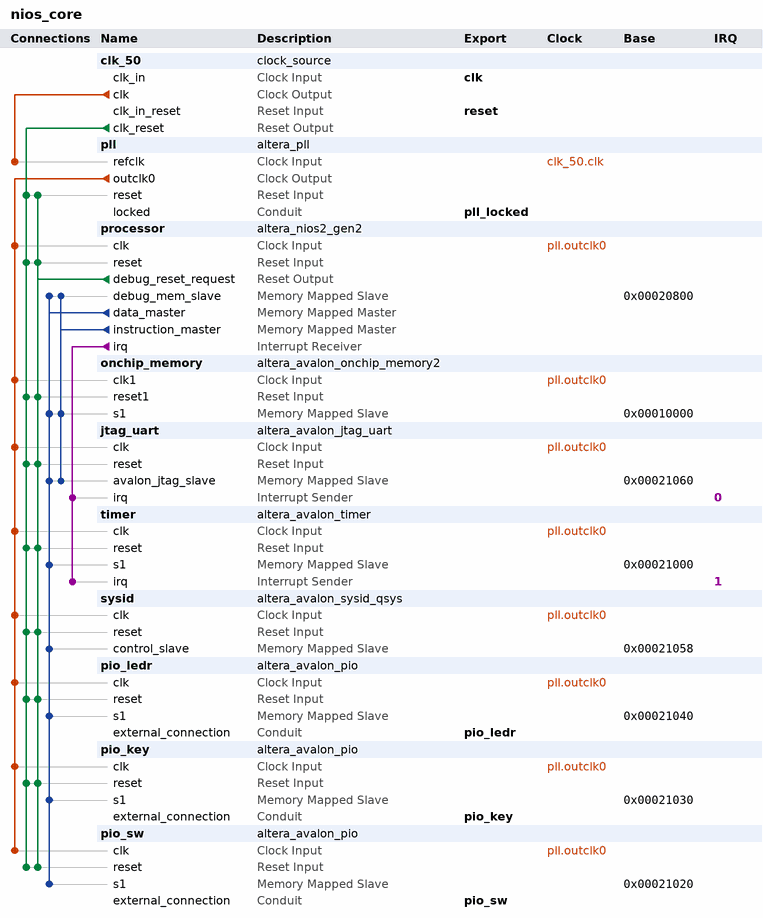
[diagram p0: system contents]
# Platform Designer (Qsys) system nios_core, Cyclone V 5CSXFC6D6F31C6
# Parameters at their usual value, and those the tool derives, are not listed.
package require -exact qsys 18.1
create_system nios_core
set_project_property DEVICE_FAMILY {Cyclone V}
set_project_property DEVICE 5CSXFC6D6F31C6

add_instance clk_50 clock_source 18.1
set_instance_parameter_value clk_50 clockFrequency 50000000

add_instance pll altera_pll 18.1
set_instance_parameter_value pll gui_device_speed_grade 1
set_instance_parameter_value pll gui_number_of_clocks 1
set_instance_parameter_value pll gui_operation_mode direct
set_instance_parameter_value pll gui_output_clock_frequency0 125.0
set_instance_parameter_value pll gui_pll_mode {Integer-N PLL}
set_instance_parameter_value pll gui_reference_clock_frequency 50.0
set_instance_parameter_value pll gui_use_locked true

add_instance processor altera_nios2_gen2 18.1
set_instance_parameter_value processor dcache_size 2048
set_instance_parameter_value processor exceptionSlave onchip_memory.s1
set_instance_parameter_value processor icache_size 4096
set_instance_parameter_value processor impl Fast
set_instance_parameter_value processor resetSlave onchip_memory.s1

add_instance onchip_memory altera_avalon_onchip_memory2 18.1
set_instance_parameter_value onchip_memory dataWidth 32
set_instance_parameter_value onchip_memory dualPort false
set_instance_parameter_value onchip_memory initMemContent true
set_instance_parameter_value onchip_memory initializationFileName onchip_mem.hex
set_instance_parameter_value onchip_memory memorySize 65536

add_instance jtag_uart altera_avalon_jtag_uart 18.1
set_instance_parameter_value jtag_uart simInteractiveOptions NO_INTERACTIVE_WINDOWS

add_instance timer altera_avalon_timer 18.1
set_instance_parameter_value timer period 1
set_instance_parameter_value timer periodUnits MSEC

add_instance sysid altera_avalon_sysid_qsys 18.1
set_instance_parameter_value sysid id 305419896

add_instance pio_ledr altera_avalon_pio 18.1
set_instance_parameter_value pio_ledr direction Output
set_instance_parameter_value pio_ledr width 8

add_instance pio_key altera_avalon_pio 18.1
set_instance_parameter_value pio_key direction Input
set_instance_parameter_value pio_key width 4

add_instance pio_sw altera_avalon_pio 18.1
set_instance_parameter_value pio_sw direction Input
set_instance_parameter_value pio_sw width 8

# connections
add_connection clk_50.clk pll.refclk clock
add_connection pll.outclk0 jtag_uart.clk clock
add_connection pll.outclk0 onchip_memory.clk1 clock
add_connection pll.outclk0 pio_key.clk clock
add_connection pll.outclk0 pio_ledr.clk clock
add_connection pll.outclk0 pio_sw.clk clock
add_connection pll.outclk0 processor.clk clock
add_connection pll.outclk0 sysid.clk clock
add_connection pll.outclk0 timer.clk clock
add_connection clk_50.clk_reset jtag_uart.reset reset
add_connection clk_50.clk_reset onchip_memory.reset1 reset
add_connection clk_50.clk_reset pio_key.reset reset
add_connection clk_50.clk_reset pio_ledr.reset reset
add_connection clk_50.clk_reset pio_sw.reset reset
add_connection clk_50.clk_reset pll.reset reset
add_connection clk_50.clk_reset processor.reset reset
add_connection clk_50.clk_reset sysid.reset reset
add_connection clk_50.clk_reset timer.reset reset
add_connection processor.debug_reset_request jtag_uart.reset reset
add_connection processor.debug_reset_request onchip_memory.reset1 reset
add_connection processor.debug_reset_request pio_key.reset reset
add_connection processor.debug_reset_request pio_ledr.reset reset
add_connection processor.debug_reset_request pio_sw.reset reset
add_connection processor.debug_reset_request pll.reset reset
add_connection processor.debug_reset_request processor.reset reset
add_connection processor.debug_reset_request sysid.reset reset
add_connection processor.debug_reset_request timer.reset reset
add_connection processor.data_master jtag_uart.avalon_jtag_slave avalon
set_connection_parameter_value processor.data_master/jtag_uart.avalon_jtag_slave baseAddress 0x00021060
add_connection processor.data_master onchip_memory.s1 avalon
set_connection_parameter_value processor.data_master/onchip_memory.s1 baseAddress 0x00010000
add_connection processor.data_master pio_key.s1 avalon
set_connection_parameter_value processor.data_master/pio_key.s1 baseAddress 0x00021030
add_connection processor.data_master pio_ledr.s1 avalon
set_connection_parameter_value processor.data_master/pio_ledr.s1 baseAddress 0x00021040
add_connection processor.data_master pio_sw.s1 avalon
set_connection_parameter_value processor.data_master/pio_sw.s1 baseAddress 0x00021020
add_connection processor.data_master processor.debug_mem_slave avalon
set_connection_parameter_value processor.data_master/processor.debug_mem_slave baseAddress 0x00020800
add_connection processor.data_master sysid.control_slave avalon
set_connection_parameter_value processor.data_master/sysid.control_slave baseAddress 0x00021058
add_connection processor.data_master timer.s1 avalon
set_connection_parameter_value processor.data_master/timer.s1 baseAddress 0x00021000
add_connection processor.instruction_master jtag_uart.avalon_jtag_slave avalon
set_connection_parameter_value processor.instruction_master/jtag_uart.avalon_jtag_slave baseAddress 0x00021060
add_connection processor.instruction_master onchip_memory.s1 avalon
set_connection_parameter_value processor.instruction_master/onchip_memory.s1 baseAddress 0x00010000
add_connection processor.instruction_master processor.debug_mem_slave avalon
set_connection_parameter_value processor.instruction_master/processor.debug_mem_slave baseAddress 0x00020800
add_connection processor.irq jtag_uart.irq interrupt
set_connection_parameter_value processor.irq/jtag_uart.irq irqNumber 0
add_connection processor.irq timer.irq interrupt
set_connection_parameter_value processor.irq/timer.irq irqNumber 1

# exported interfaces
add_interface clk clock sink
set_interface_property clk EXPORT_OF clk_50.clk_in
add_interface pio_key conduit end
set_interface_property pio_key EXPORT_OF pio_key.external_connection
add_interface pio_ledr conduit end
set_interface_property pio_ledr EXPORT_OF pio_ledr.external_connection
add_interface pio_sw conduit end
set_interface_property pio_sw EXPORT_OF pio_sw.external_connection
add_interface pll_locked conduit end
set_interface_property pll_locked EXPORT_OF pll.locked
add_interface reset reset sink
set_interface_property reset EXPORT_OF clk_50.clk_in_reset

set_interconnect_requirement {$system} qsys_mm.clockCrossingAdapter HANDSHAKE
set_interconnect_requirement {$system} qsys_mm.enableEccProtection FALSE
set_interconnect_requirement {$system} qsys_mm.insertDefaultSlave FALSE
set_interconnect_requirement {$system} qsys_mm.maxAdditionalLatency 1

save_system nios_core.qsys
